# EAGLE design SID6582_adapter (EAGLE 5.11)
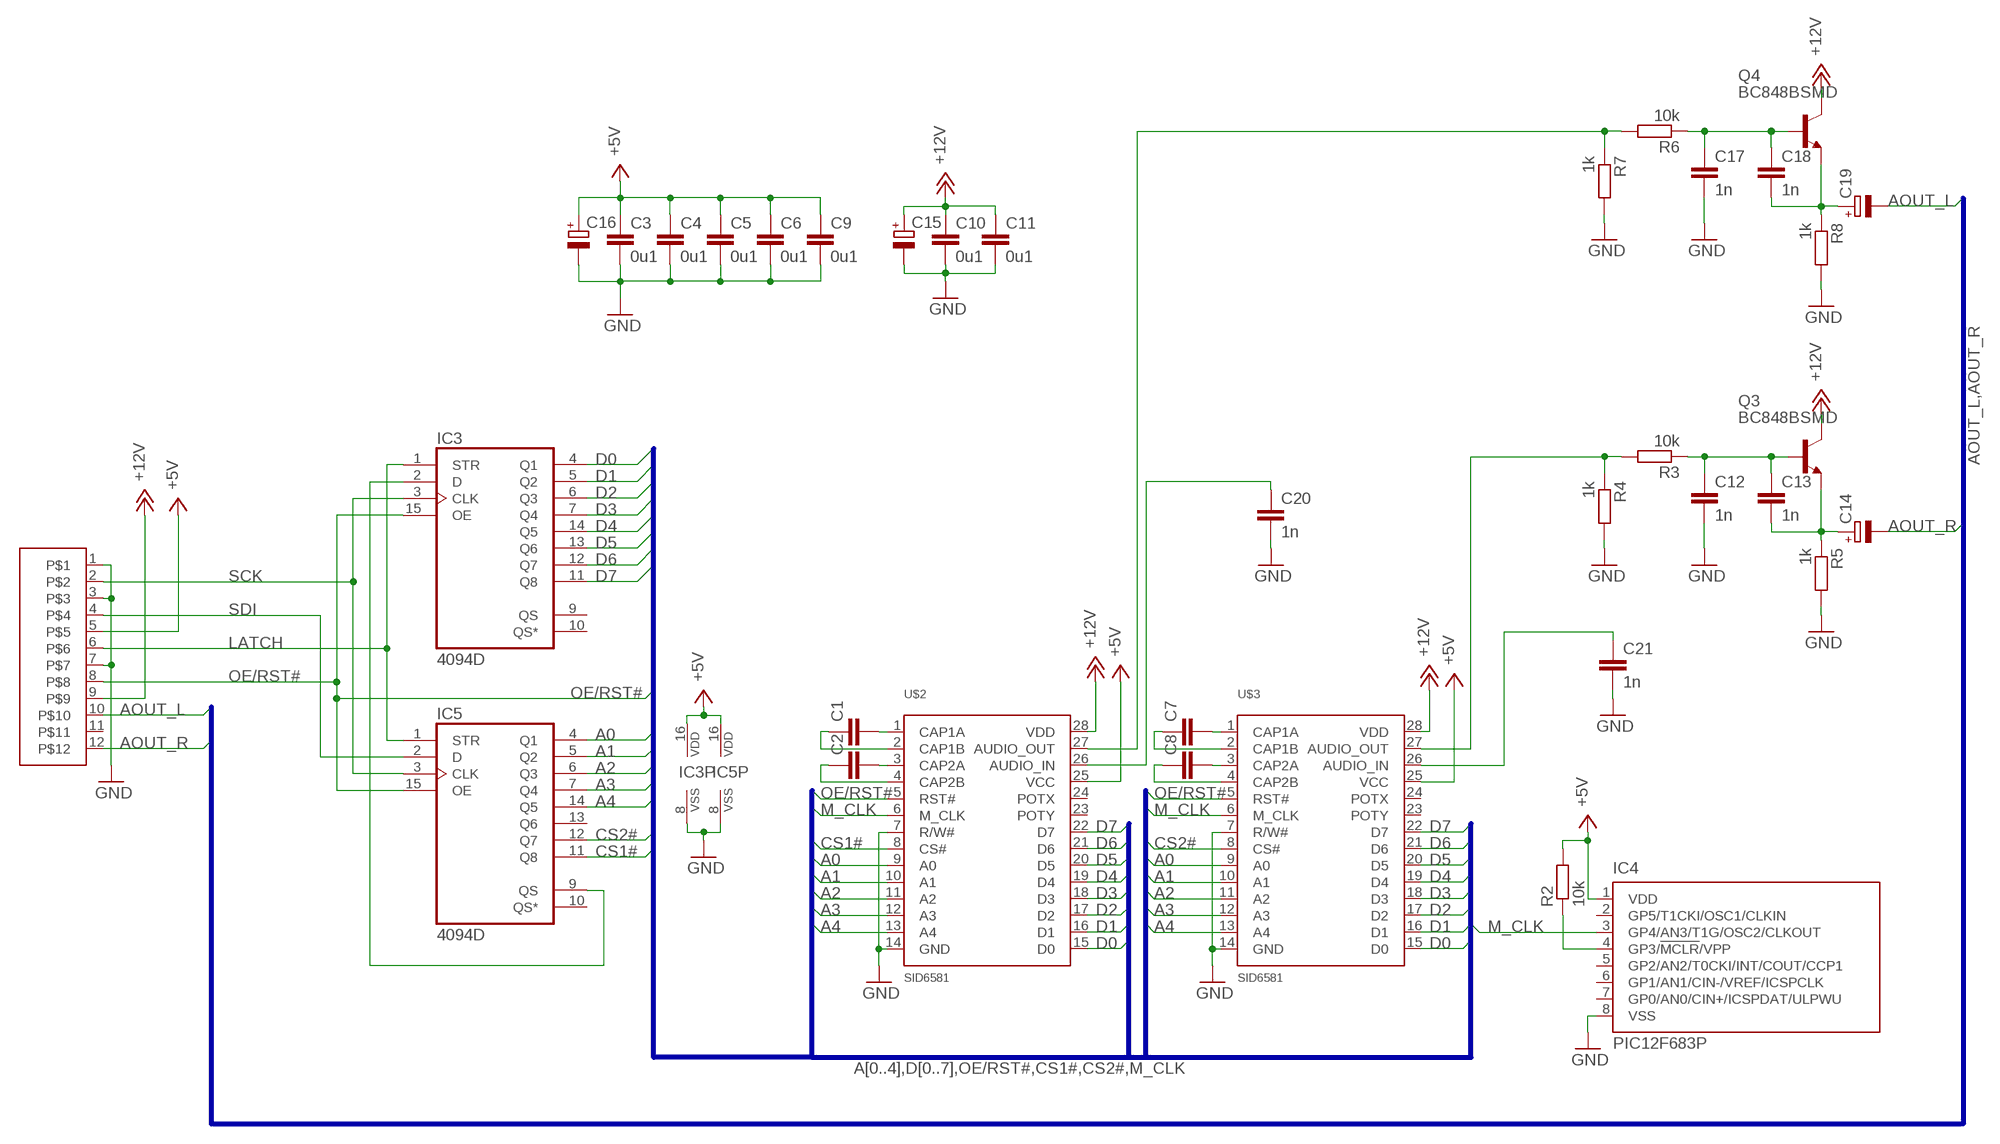
[diagram p0: schematic, sheet 1]

## Parts
C1  C-EU050-025X075  [C050-025X075]
C2  C-EU050-025X075  [C050-025X075]
C3  0u1  C-EUC0603  [C0603]
C4  0u1  C-EUC0603  [C0603]
C5  0u1  C-EUC0603  [C0603]
C6  0u1  C-EUC0603  [C0603]
C7  C-EU050-025X075  [C050-025X075]
C8  C-EU050-025X075  [C050-025X075]
C9  0u1  C-EUC0603  [C0603]
C10  0u1  C-EUC0603  [C0603]
C11  0u1  C-EUC0603  [C0603]
C12  1n  C-EUC0402  [C0402]
C13  1n  C-EUC0402  [C0402]
C14  CPOL-EUE2.5-5  [E2,5-5]
C15  CPOL-EUE2.5-5  [E2,5-5]
C16  CPOL-EUE2.5-5  [E2,5-5]
C17  1n  C-EUC0402  [C0402]
C18  1n  C-EUC0402  [C0402]
C19  CPOL-EUE2.5-5  [E2,5-5]
C20  1n  C-EUC0402  [C0402]
C21  1n  C-EUC0402  [C0402]
IC3  4094D  [SO16]
IC4  PIC12F683P  [DIL8]
IC5  4094D  [SO16]
Q3  BC848BSMD  [SOT23]
Q4  BC848BSMD  [SOT23]
R2  10k  R-EU_R0402  [R0402]
R3  10k  R-EU_R0402  [R0402]
R4  1k  R-EU_R0402  [R0402]
R5  1k  R-EU_R0402  [R0402]
R6  10k  R-EU_R0402  [R0402]
R7  1k  R-EU_R0402  [R0402]
R8  1k  R-EU_R0402  [R0402]
U$1  SMD_PCBEDGE_HDC12  [SMD_PCB_EGGE_HDC12]
U$2  SID6581  [DIL28]
U$3  SID6581  [DIL28]

## Nets
+5V: C3.1 C4.1 C5.1 C6.1 C9.1 C16.+ IC3.16(VDD) IC4.1(VDD) IC5.16(VDD) R2.2 U$1.5 U$2.25(VCC) U$3.25(VCC)
+12V: C10.1 C11.1 C15.+ Q3.3(C) Q4.3(C) U$1.9 U$2.28(VDD) U$3.28(VDD)
A0: IC5.4(Q1) U$2.9(A0) U$3.9(A0)
A1: IC5.5(Q2) U$2.10(A1) U$3.10(A1)
A2: IC5.6(Q3) U$2.11(A2) U$3.11(A2)
A3: IC5.7(Q4) U$2.12(A3) U$3.12(A3)
A4: IC5.14(Q5) U$2.13(A4) U$3.13(A4)
AOUT_L: C19.- U$1.10
AOUT_R: C14.- U$1.12
CS1#: IC5.11(Q8) U$2.8(CS#)
CS2#: IC5.12(Q7) U$3.8(CS#)
D0: IC3.4(Q1) U$2.15(D0) U$3.15(D0)
D1: IC3.5(Q2) U$2.16(D1) U$3.16(D1)
D2: IC3.6(Q3) U$2.17(D2) U$3.17(D2)
D3: IC3.7(Q4) U$2.18(D3) U$3.18(D3)
D4: IC3.14(Q5) U$2.19(D4) U$3.19(D4)
D5: IC3.13(Q6) U$2.20(D5) U$3.20(D5)
D6: IC3.12(Q7) U$2.21(D6) U$3.21(D6)
D7: IC3.11(Q8) U$2.22(D7) U$3.22(D7)
GND: C3.2 C4.2 C5.2 C6.2 C9.2 C10.2 C11.2 C12.2 C15.- C16.- C17.2 C20.2 C21.2 IC3.8(VSS) IC4.8(VSS) IC5.8(VSS) R4.2 R5.2 R7.2 R8.2 U$1.1 U$1.3 U$1.7 U$2.7(R/W#) U$2.14(GND) U$3.7(R/W#) U$3.14(GND)
LATCH: IC3.1(STR) IC5.1(STR) U$1.6
M_CLK: IC4.3(GP4/AN3/T1G/OSC2/CLKOUT) U$2.6(M_CLK) U$3.6(M_CLK)
N$1: C1.2 U$2.1(CAP1A)
N$2: C2.2 U$2.3(CAP2A)
N$3: C1.1 U$2.2(CAP1B)
N$4: C2.1 U$2.4(CAP2B)
N$5: C7.2 U$3.1(CAP1A)
N$6: C8.2 U$3.3(CAP2A)
N$7: C7.1 U$3.2(CAP1B)
N$8: C8.1 U$3.4(CAP2B)
N$9: IC3.2(D) IC5.9(QS)
N$11: R3.2 R4.1 U$3.27(AUDIO_OUT)
N$12: C12.1 C13.1 Q3.1(B) R3.1
N$13: C13.2 C14.+ Q3.2(E) R5.1
N$15: IC4.4(GP3/!MCLR!/VPP) R2.1
N$18: R6.2 R7.1 U$2.27(AUDIO_OUT)
N$19: C17.1 C18.1 Q4.1(B) R6.1
N$20: C18.2 C19.+ Q4.2(E) R8.1
N$23: C21.1 U$3.26(AUDIO_IN)
N$24: C20.1 U$2.26(AUDIO_IN)
OE/RST#: IC3.15(OE) IC5.15(OE) U$1.8 U$2.5(RST#) U$3.5(RST#)
SCK: IC3.3(CLK) IC5.3(CLK) U$1.2
SDI: IC5.2(D) U$1.4
Unconnected: IC3.9(QS) IC3.10(QS*) IC4.2(GP5/T1CKI/OSC1/CLKIN) IC4.5(GP2/AN2/T0CKI/INT/COUT/CCP1) IC4.6(GP1/AN1/CIN-/VREF/ICSPCLK) IC4.7(GP0/AN0/CIN+/ICSPDAT/ULPWU) IC5.10(QS*) IC5.13(Q6) U$1.11 U$2.23(POTY) U$2.24(POTX) U$3.23(POTY) U$3.24(POTX)

## Buses
A[0..4],D[0..7],OE/RST#,CS1#,CS2#,M_CLK
AOUT_L,AOUT_R

## Library data of the parts
C1-C13 C17 C18 C20 C21 = rcl:C-EU: CAPACITOR, European symbol
C14-C16 C19 = rcl:CPOL-EU: POLARIZED CAPACITOR, European symbol
IC3 IC5 = 40xx:4094: 8-stage SHIFT/STORE REGISTER, tri-state
IC4 = microchip:PIC12F683: 8-Pin Flash-Based, 8-Bit CMOS Microcontrollers with nanoWatt Technology Source: http://ww1.microchip.com/downloads/en/DeviceDoc/41211D_.pdf; MF: MICROCHIP; MPN: PIC12F683-I/P; OC_FARNELL: 9759034; OC_NEWARK: 89H0442
Q3 Q4 = transistor-npn:BC848*: NPN Transistor
R2-R8 = rcl:R-EU_: RESISTOR, European symbol
U$1 = edgeMounted_HDC:SMD_PCBEDGE_HDC12
U$2 U$3 = SID6581:SID6581

## Board
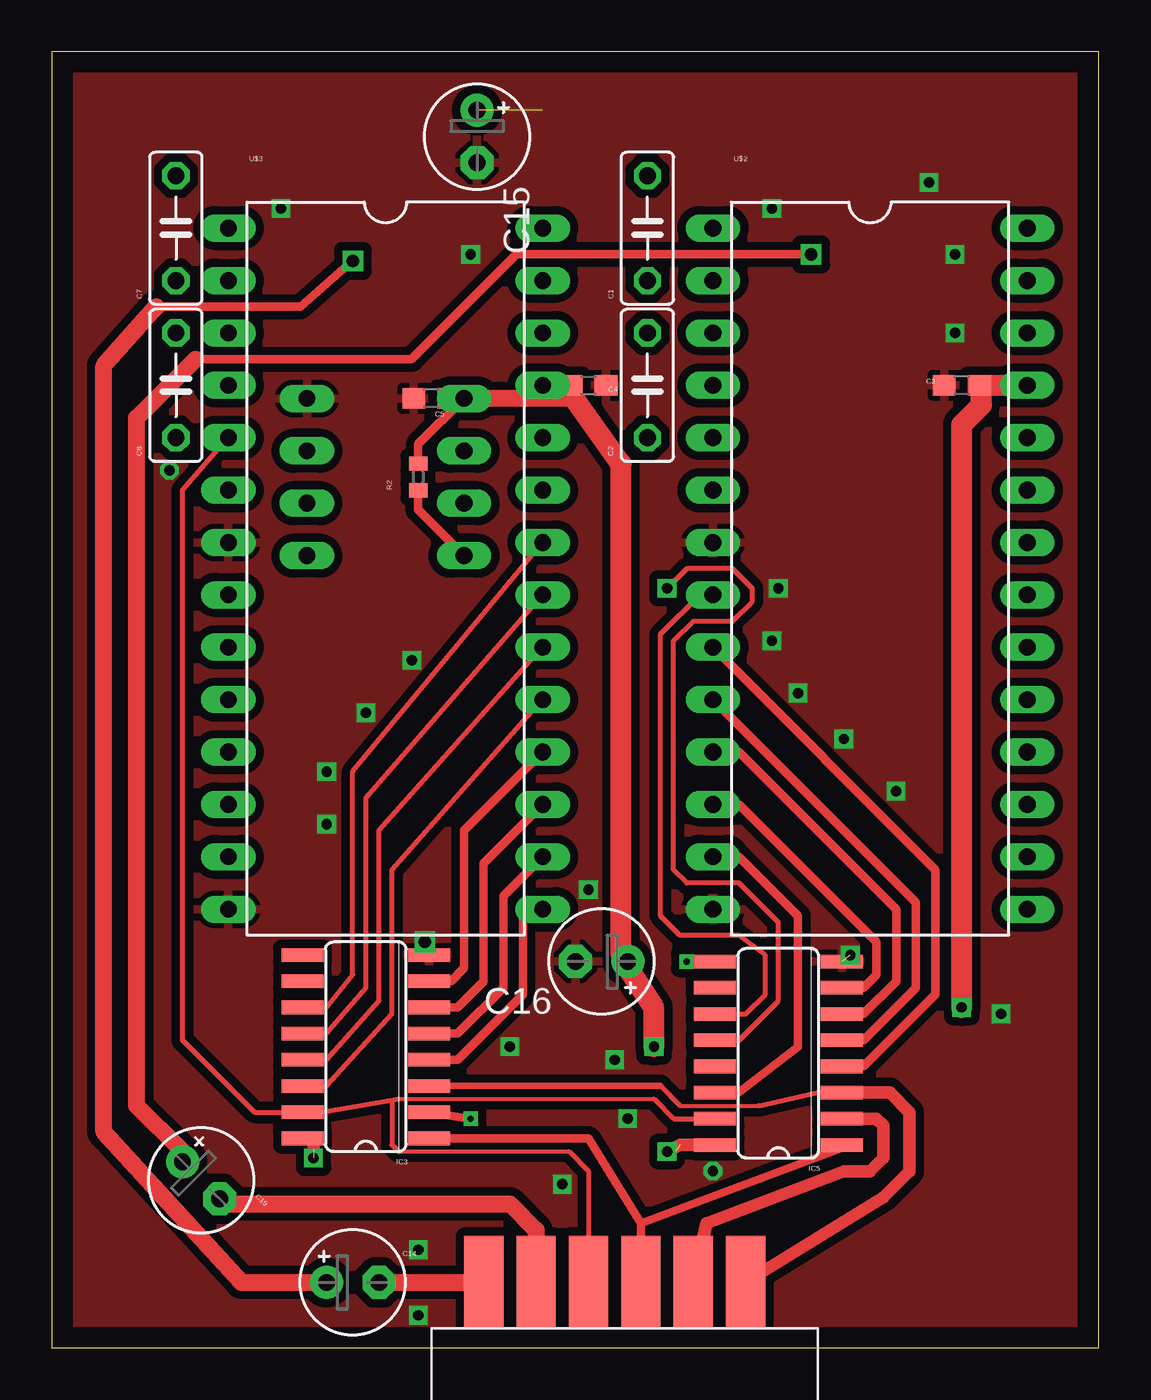
[diagram p1: board, top side]
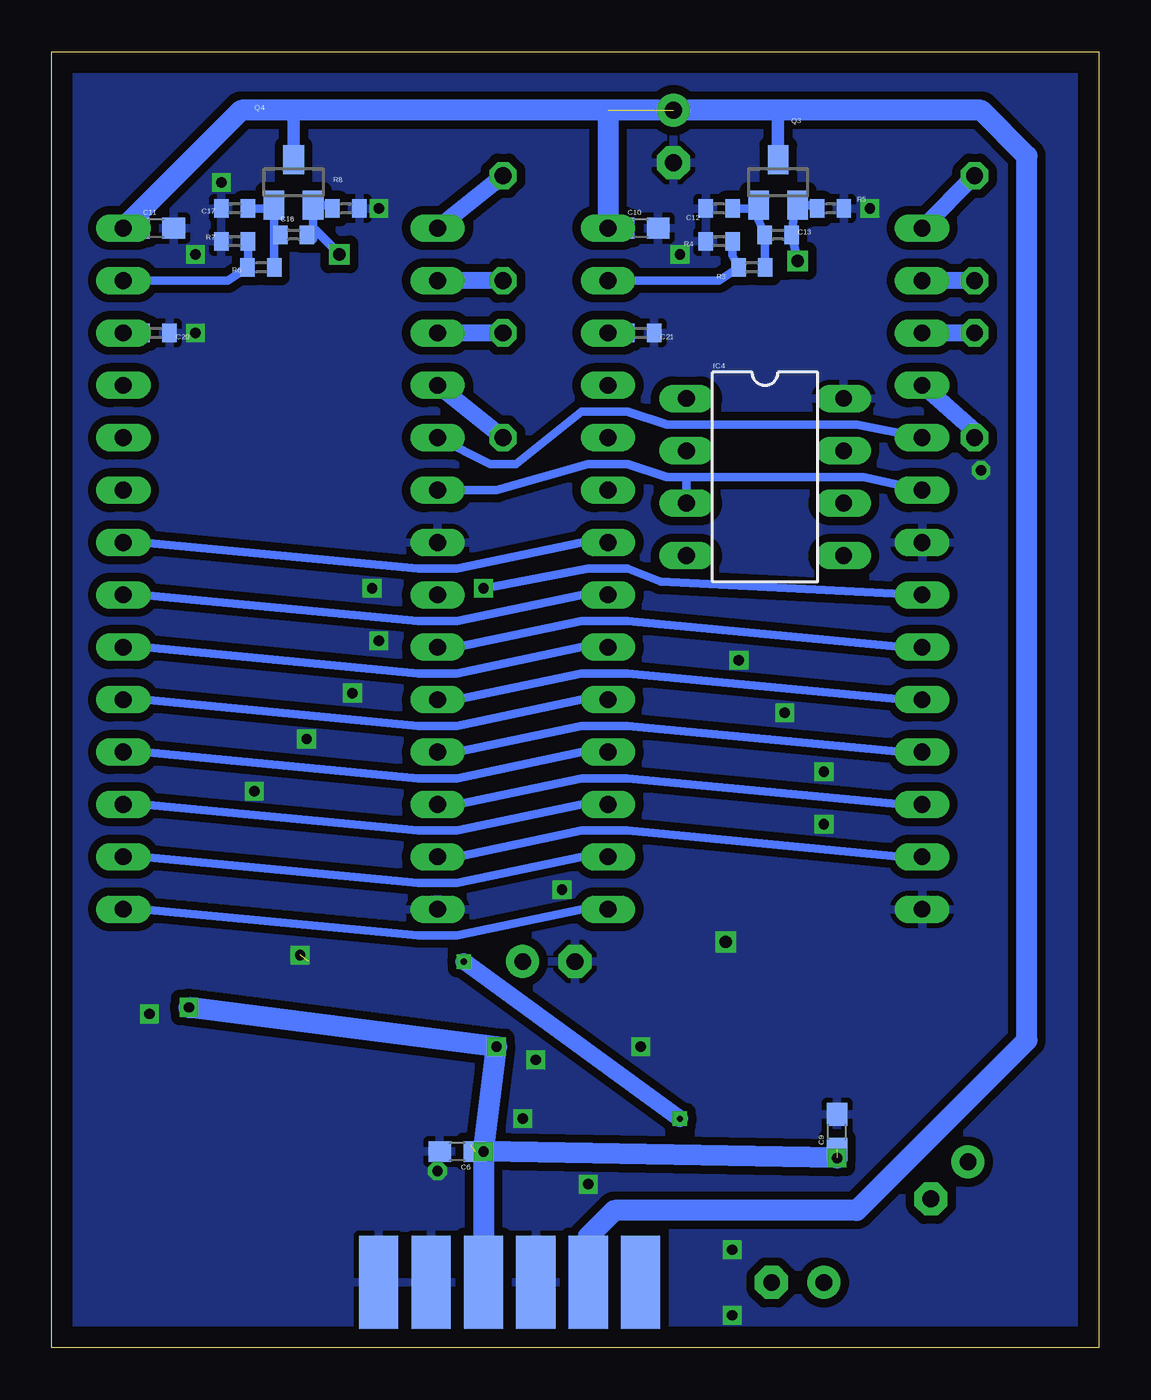
[diagram p2: board, bottom side, seen from below]

Size 50.79 x 62.85 mm. Coordinates in mm from the lower left corner, seen from the top.
Outline: 0,0 50.79,0 50.79,62.85 0,62.85 0,0
Copper layers (1*16): Top 0.035mm / dielectric 1.5mm / Bottom 0.035mm
Design rules "default": minimum track width 10mil, minimum drill 24mil, track to track 8mil, track to pad 8mil, pad to pad 8mil, via to via 8mil, smd to smd 8mil, copper to edge 40mil, drill to drill 8mil, minimum pad ring 10mil, minimum via ring 8mil, stop-mask expansion 4mil, vias tented up to drill 0mil, thermal gap 10mil

### Footprints (pad centres in the part's own frame; a part is rotated, then mirrored left to right if it is on the bottom)
C050-025X075 = drill 0.813 octagon: 1 -2.54,0; 2 2.54,0
C0603 = smd 1.1 x 1: 1 -0.85,0; 2 0.85,0
C0402 = smd 0.7 x 0.9: 1 -0.65,0; 2 0.65,0
E2,5-5 = drill 0.813 pad 1.6 round: + -1.27,0 | drill 0.813 pad 1.6 octagon: - 1.27,0
SO16 = smd 0.66 x 2.032: 1 -4.445,-3.073; 2 -3.175,-3.073; 3 -1.905,-3.073; 4 -0.635,-3.073; 5 0.635,-3.073; 6 1.905,-3.073; 7 3.175,-3.073; 8 4.445,-3.073; 9 4.445,3.073; 10 3.175,3.073; 11 1.905,3.073; 12 0.635,3.073; 13 -0.635,3.073; 14 -1.905,3.073; 15 -3.175,3.073; 16 -4.445,3.073
DIL8 = drill 0.813 long: 1 -3.81,-3.81; 2 -1.27,-3.81; 3 1.27,-3.81; 4 3.81,-3.81; 5 3.81,3.81; 6 1.27,3.81; 7 -1.27,3.81; 8 -3.81,3.81
SOT23 = smd 1 x 1.4: 1 -0.95,-1.1; 2 0.95,-1.1; 3 0,1.1
R0402 = smd 0.7 x 0.9: 1 -0.65,0; 2 0.65,0
SMD_PCB_EGGE_HDC12 = smd 4.5 x 1.9 bottom: 1 2.54,-7.62; 3 2.54,-5.08; 5 2.54,-2.54; 7 2.54,0; 9 2.54,2.54; 11 2.54,5.08 | smd 4.5 x 1.9: 2 2.54,-6.35; 4 2.54,-3.81; 6 2.54,-1.27; 8 2.54,1.27; 10 2.54,3.81; 12 2.54,6.35
DIL28 = drill 0.813 long: 1 -16.51,-7.62; 2 -13.97,-7.62; 3 -11.43,-7.62; 4 -8.89,-7.62; 5 -6.35,-7.62; 6 -3.81,-7.62; 7 -1.27,-7.62; 8 1.27,-7.62; 9 3.81,-7.62; 10 6.35,-7.62; 11 8.89,-7.62; 12 11.43,-7.62; 13 13.97,-7.62; 14 16.51,-7.62; 15 16.51,7.62; 16 13.97,7.62; 17 11.43,7.62; 18 8.89,7.62; 19 6.35,7.62; 20 3.81,7.62; 21 1.27,7.62; 22 -1.27,7.62; 23 -3.81,7.62; 24 -6.35,7.62; 25 -8.89,7.62; 26 -11.43,7.62; 27 -13.97,7.62; 28 -16.51,7.62

### Placement (x,y rotation side)
C1  28.89,54.29 90 top
C2  28.89,46.67 90 top
C3  44.13,46.67 180 top
C4  26.04,46.67 0 top
C5  18.41,46.04 180 top
C6  31.11,9.53 180 bottom
C7  6.03,54.29 90 top
C8  6.03,46.67 90 top
C9  12.7,10.48 90 bottom
C10  22.23,54.29 0 bottom
C11  45.72,54.29 0 bottom
C12  18.41,55.24 180 bottom
C13  15.56,53.98 0 bottom
C14  14.61,3.17 0 top
C15  20.64,58.74 270 top
C16  26.67,18.73 180 top
C17  41.91,55.24 180 bottom
C18  39.05,53.98 0 bottom
C19  7.25,8.12 315 top
C20  45.72,49.21 0 bottom
C21  22.23,49.21 0 bottom
IC3  15.24,14.61 90 top
IC4  16.19,42.23 270 bottom
IC5  35.24,14.29 90 top
Q3  15.56,56.52 0 bottom
Q4  39.05,56.52 0 bottom
R2  17.78,42.23 90 top
R3  16.83,52.39 180 bottom
R4  18.41,53.66 180 bottom
R5  13.02,55.24 0 bottom
R6  40.64,52.39 180 bottom
R7  41.91,53.66 180 bottom
R8  36.51,55.24 0 bottom
U$1  27.3,0.64 90 top
U$2  39.69,37.78 270 top
U$3  16.19,37.78 270 top

### Tracks (layer width: path | path; a pad name or v marks a point on that pad's centre or on a via)
+5V  (via drill 0.5)  (2 unrouted)
  Top 0.406: IC3.16 12.7,10.06 | C4.1 24.34,46.77 U$3.25 | C5.1 IC4.1 17.78,43.81 R2.2
  Top 0.61: v29.84,9.53 30.48,9.84 IC5.16 | 12.7,10.06 v12.7,9.21
  Top 0.813: IC4.1 25.34,46.04 24.95,46.6
  Top 1.016: v29.21,14.61 29.21,16.51 27.94,18.41 C16.+ 27.62,19.05 27.62,42.86 24.95,46.6 U$3.25 | v44.13,16.51 44.13,44.77 45.09,45.72 45.09,46.57 C3.1 U$2.25
  Bottom 1.016: v29.84,9.53 U$1.5 | v29.84,9.53 v29.21,14.61 v44.13,16.51 | v12.7,9.21 v29.84,9.53
+12V  (1 unrouted)
  Bottom 0.61: 15.56,60.01 Q3.3 | 39.05,60.01 Q4.3
  Bottom 1.016: U$1.9 24.77,5.4 23.5,6.67 11.75,6.67 3.49,14.92 3.49,57.78 5.71,60.01 15.56,60.01 23.81,60.01 | 23.81,60.01 39.05,60.01 41.59,60.01 U$2.28 C11.1 | C10.1 U$3.28 23.81,60.01
A0
  Top 0.406: IC5.4 39.37,13.65 42.86,17.14 42.86,23.18 U$2.9
  Bottom 0.406: U$3.9 9.53,33.97 22.86,35.24 25.08,35.24 31.11,33.97 U$2.9
A1
  Top 0.406: IC5.5 39.37,14.92 41.91,17.46 41.91,21.59 U$2.10
  Bottom 0.406: U$3.10 9.53,31.43 22.86,32.7 25.08,32.7 31.11,31.43 U$2.10
A2
  Top 0.406: IC5.6 39.37,16.19 40.96,17.78 40.96,21.27 33.34,28.89 U$2.11
  Bottom 0.406: 9.53,28.89 22.86,30.16 25.08,30.16 31.11,28.89 U$2.11
  Bottom 0.61: U$3.11 9.53,28.89
A3
  Top 0.406: IC5.7 39.37,17.46 40.01,18.1 40.01,19.68 33.34,26.35 U$2.12
  Bottom 0.406: U$3.12 9.53,26.35 22.86,27.62 25.08,27.62 31.11,26.35 U$2.12
A4
  Top 0.406: IC5.14 33.34,12.38 36.2,14.61 36.2,20.95 33.34,23.81 U$2.13
  Bottom 0.406: U$3.13 9.53,23.81 22.86,25.08 25.08,25.08 31.11,23.81 U$2.13
AOUT_L
  Top 0.813: U$1.10 23.5,5.71 22.23,6.99 8.39,6.99 C19.-
AOUT_R
  Top 0.813: C14.- U$1.12
CS1#
  Top 0.254: IC5.11 33.66,16.19 34.61,17.14 34.61,19.05 33.34,20 30.48,20 29.53,20.95 29.53,34.61 31.43,36.51 U$2.8
CS2#  (via drill 0.5)
  Top 0.254: IC5.12 33.34,14.92 35.24,16.83 35.24,20.64 33.34,22.54 30.8,22.54 30.16,23.18 30.16,34.29 31.11,35.24 33.02,35.24 33.97,36.2 33.97,36.83 33.02,37.78 30.8,37.78 v29.84,36.83
  Bottom 0.406: v29.84,36.83 24.77,37.78 22.86,37.78 21.27,37.15 U$3.8
D0
  Top 0.406: IC3.4 19.68,13.97 22.86,17.14 22.86,21.27 U$3.15
  Bottom 0.406: U$3.15 25.08,21.27 31.11,20 33.02,20 46.35,21.27 U$2.15
D1
  Top 0.406: IC3.5 19.68,15.24 21.91,17.46 21.91,21.91 U$3.16
  Bottom 0.406: U$3.16 25.08,23.81 31.11,22.54 33.02,22.54 46.35,23.81 U$2.16
D2
  Top 0.406: IC3.6 19.68,16.51 20.95,17.78 20.95,23.5 U$3.17
  Bottom 0.406: U$3.17 25.08,26.35 31.11,25.08 33.02,25.08 46.35,26.35 U$2.17
D3
  Top 0.406: IC3.7 19.37,17.78 20,18.41 20,25.08 U$3.18
  Bottom 0.406: U$3.18 25.08,28.89 31.11,27.62 33.02,27.62 46.35,28.89 U$2.18
D4
  Top 0.254: IC3.14 13.34,12.7 16.51,16.19 16.51,23.18 U$3.19
  Bottom 0.406: U$3.19 25.08,31.43 31.11,30.16 33.02,30.16 46.35,31.43 U$2.19
D5
  Top 0.254: IC3.13 13.34,13.97 15.88,16.83 15.88,25.08 U$3.20
  Bottom 0.406: U$3.20 25.08,33.97 31.11,32.7 33.02,32.7 46.35,33.97 U$2.20
D6
  Top 0.254: IC3.12 13.34,15.24 15.24,17.46 15.24,26.67 U$3.21
  Bottom 0.406: U$3.21 25.08,36.51 31.11,35.24 33.02,35.24 46.35,36.51 U$2.21
D7
  Top 0.254: IC3.11 13.34,16.51 14.61,18.1 14.61,27.94 U$3.22
  Bottom 0.406: U$3.22 25.08,39.05 31.11,37.78 33.02,37.78 46.35,39.05 U$2.22
GND  (via drill 0.5, 0.6)  (1 unrouted)
  other vias: 46.04,16.19 18.1,19.68 38.73,19.05 17.78,4.76 17.78,1.59 24.77,7.94 22.23,14.61 27.3,13.97 26.04,22.23 40.96,26.99 38.42,29.53 36.2,31.75 34.92,34.29 35.24,36.83 17.46,33.34 15.24,30.8 13.34,27.94 13.34,25.4 32.07,8.57 27.94,11.11 34.92,55.24 42.55,56.52 43.81,49.21 43.81,53.02 20.32,53.02 11.11,55.24 5.71,42.55
  pour Bottom (isolate 0.406): 0,0 51.12,0 51.12,62.87 0,62.87
  pour Top (isolate 0.406): 0,0 51.12,0 51.12,62.87 0,62.87
LATCH
  Top 0.406: IC3.1 26.04,10.16 28.57,6.03 | 28.57,6.03 U$1.6 | IC5.1 38.73,9.84 28.57,6.03
M_CLK
  Bottom 0.406: U$2.6 29.21,41.59 24.77,42.86 22.86,42.86 20.95,42.23 20,42.23 | 20,42.23 11.43,42.23 U$3.6 | 20,42.23 IC4.3
N$1
  Bottom 0.813: C1.2 U$2.1
N$2
  Bottom 0.813: C2.2 U$2.3
N$3
  Bottom 0.813: C1.1 U$2.2
N$4
  Bottom 0.813: C2.1 U$2.4
N$5
  Bottom 0.813: C7.2 U$3.1
N$6
  Bottom 0.813: C8.2 U$3.3
N$7
  Bottom 0.813: C7.1 U$3.2
N$8
  Bottom 0.813: C8.1 6.03,44.45 U$3.4
N$9  (via drill 0.3)
  Top 0.406: IC3.2 v20.32,11.11 | v30.8,18.73 IC5.9
  Bottom 0.813: v20.32,11.11 v30.8,18.73
N$11
  Bottom 0.406: R4.1 17.77,52.99 R3.2 18.43,51.75 U$3.27
N$12
  Bottom 0.406: 16.68,55.24 C12.1 | Q3.1 16.51,54.71 C13.1 16.21,52.73 R3.1
  Bottom 0.61: Q3.1 16.68,55.24
N$13  (via drill 0.6)
  Top 0.406: 5.08,50.48 12.06,50.48 v14.61,52.7
  Top 0.813: C14.+ 9.21,3.17 2.54,10.48 2.54,47.62 5.08,50.48
  Bottom 0.406: 14.71,55.31 C13.2 v14.61,52.7 | R5.1 13.67,55.41 Q3.2
  Bottom 0.61: 14.71,55.31 Q3.2
N$15
  Top 0.406: IC4.4 17.77,40.64 R2.1
N$18
  Bottom 0.406: R7.1 41.26,52.73 R6.2 42.24,51.75 U$2.27
N$19
  Bottom 0.406: 40.17,55.24 C17.1 | Q4.1 40,53.76 C18.1 39.99,53.69 R6.1
  Bottom 0.61: Q4.1 40.17,55.24
N$20  (via drill 0.6)
  Top 0.406: 6.99,47.94 17.46,47.94 22.54,53.02 v36.83,53.02
  Top 0.813: C19.+ 6.35,9.53 4.13,11.75 4.13,45.09 6.99,47.94
  Bottom 0.406: 37.31,55.41 Q4.2 38.1,53.76 C18.2 38.09,54.29 v36.83,53.02
  Bottom 0.61: 37.31,55.41 R8.1
N$23
  Bottom 0.406: C21.1 U$3.26
N$24
  Bottom 0.406: U$2.26 C20.1
OE/RST#
  Top 0.2: 16.83,12.06 29.21,12.06 | 16.83,9.53 25.08,9.53
  Top 0.254: IC5.15 30.16,11.11 29.21,12.06 | 16.42,12 13.02,11.43 IC3.15 9.84,11.43 6.35,14.92 6.35,41.59 U$3.5 | 16.42,12 16.83,12.06 | U$1.8 26.04,8.57 25.08,9.53 | 16.83,9.53 16.51,9.84 16.51,11.9 16.42,12
  Bottom 0.406: U$3.5 11.75,44.77 20.95,44.77 22.86,45.4 25.08,45.4 28.26,42.86 29.53,42.86 U$2.5
SCK
  Top 0.2: 30.48,11.75 34.29,11.75
  Top 0.254: 29.53,12.7 30.48,11.75 | IC5.3 37.15,12.38 34.29,11.75
  Top 0.305: IC3.3 29.53,12.7
  Top 0.61: U$1.2 40.32,7.3 41.59,8.57 41.59,11.43 40.64,12.38 IC5.3
SDI
  Top 0.61: U$1.4 31.75,6.03 38.42,8.57 39.69,8.57 40.32,9.21 40.32,10.79 40.01,11.11 IC5.2